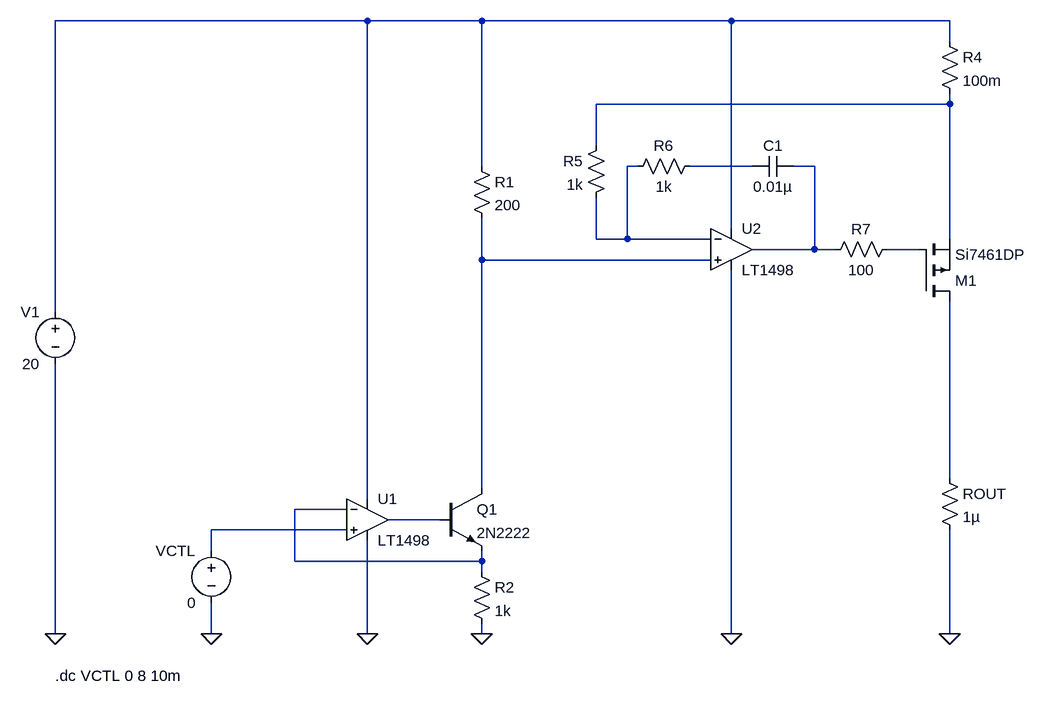
[diagram p0: schematic Controlled_Constant_Current_Source.asc]
Controlled_Constant_Current_Source.asc, the LTspice schematic file:
Version 4.1
SHEET 1 880 768
WIRE -464 -256 -944 -256
WIRE -288 -256 -464 -256
WIRE 96 -256 -288 -256
WIRE 432 -256 96 -256
WIRE 432 -224 432 -256
WIRE 432 -128 432 -144
WIRE 432 -128 -112 -128
WIRE -112 -64 -112 -128
WIRE -288 -32 -288 -256
WIRE -48 -32 -64 -32
WIRE 128 -32 32 -32
WIRE 224 -32 192 -32
WIRE 96 64 96 -256
WIRE -112 80 -112 16
WIRE -64 80 -64 -32
WIRE -64 80 -112 80
WIRE 64 80 -64 80
WIRE 432 80 432 -128
WIRE 224 96 224 -32
WIRE 224 96 128 96
WIRE 256 96 224 96
WIRE 384 96 336 96
WIRE -288 112 -288 48
WIRE 64 112 -288 112
WIRE -944 192 -944 -256
WIRE 432 448 432 176
WIRE -288 464 -288 112
WIRE -464 480 -464 -256
WIRE -496 496 -576 496
WIRE -352 512 -432 512
WIRE -496 528 -704 528
WIRE -704 560 -704 528
WIRE -576 576 -576 496
WIRE -288 576 -288 560
WIRE -288 576 -576 576
WIRE -288 592 -288 576
WIRE -944 688 -944 272
WIRE -704 688 -704 640
WIRE -464 688 -464 544
WIRE -288 688 -288 672
WIRE 96 688 96 128
WIRE 432 688 432 528
FLAG -944 688 0
FLAG -464 688 0
FLAG -288 688 0
FLAG 432 688 0
FLAG -704 688 0
FLAG 96 688 0
SYMBOL pmos 384 176 M180
SYMATTR InstName M1
SYMATTR Value Si7461DP
SYMBOL voltage -944 176 M0
WINDOW 123 0 0 Left 0
WINDOW 39 0 0 Left 0
SYMATTR InstName V1
SYMATTR Value 20
SYMBOL res -304 -48 R0
SYMATTR InstName R1
SYMATTR Value 200
SYMBOL OpAmps\\LT1498 -464 448 R0
SYMATTR InstName U1
SYMBOL npn -352 464 R0
SYMATTR InstName Q1
SYMATTR Value 2N2222
SYMBOL res -304 576 R0
SYMATTR InstName R2
SYMATTR Value 1k
SYMBOL res 416 432 R0
SYMATTR InstName ROUT
SYMATTR Value 1µ
SYMBOL voltage -704 544 M0
WINDOW 123 0 0 Left 0
WINDOW 39 0 0 Left 0
SYMATTR InstName VCTL
SYMATTR Value 0
SYMBOL OpAmps\\LT1498 96 32 R0
SYMATTR InstName U2
SYMBOL res 416 -240 R0
SYMATTR InstName R4
SYMATTR Value 100m
SYMBOL res -96 -80 M0
SYMATTR InstName R5
SYMATTR Value 1k
SYMBOL res 48 -48 R90
WINDOW 0 0 56 VBottom 2
WINDOW 3 32 56 VTop 2
SYMATTR InstName R6
SYMATTR Value 1k
SYMBOL cap 192 -48 R90
WINDOW 0 0 32 VBottom 2
WINDOW 3 32 32 VTop 2
SYMATTR InstName C1
SYMATTR Value 0.01µ
SYMBOL res 352 80 R90
WINDOW 0 0 56 VBottom 2
WINDOW 3 32 56 VTop 2
SYMATTR InstName R7
SYMATTR Value 100
TEXT -944 752 Left 2 !.dc VCTL 0 8 10m

The netlist it stands for:
* Controlled_Constant_Current_Source.asc
M1 N008 N006 N002 N002 Si7461DP
V1 N001 0 20
R1 N001 N007 200
X§U1 N011 N009 N001 0 N010 LT1498  ; pins In+ In- V+ V- OUT
Q1 N007 N010 N009 0 2N2222
R2 N009 0 1k
ROUT N008 0 1µ
VCTL N011 0 0
X§U2 N007 N003 N001 0 N005 LT1498  ; pins In+ In- V+ V- OUT
R4 N001 N002 100m
R5 N002 N003 1k
R6 N004 N003 1k
C1 N005 N004 0.01µ
R7 N006 N005 100
.model NPN NPN
.model PNP PNP
.lib standard.bjt
.model NMOS NMOS
.model PMOS PMOS
.lib standard.mos
.dc VCTL 0 8 10m
.lib LTC.lib
.backanno
.end